# Altium project esp32_and_bmi270.PrjPcb
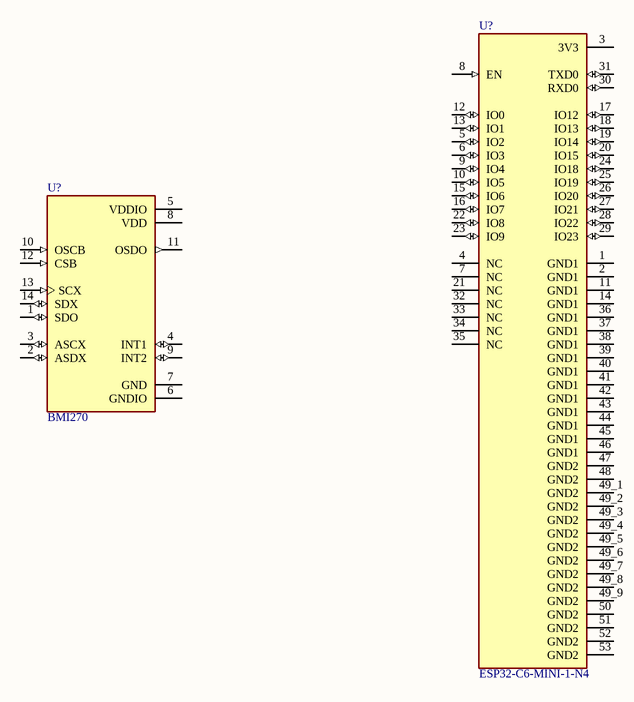
[diagram p0: Sheet1.SchDoc]
1 sheet, 2 parts. Net scope: global (net labels, ports and power ports of the same name join across sheets).
Board file: PCB1.PcbDoc

## Sheet Sheet1.SchDoc
size A4; SheetNumber: 1; SheetTotal: 1

### Parts
(Parts that share a designator on the sheet are numbered #1, #2 ... from top to bottom, then left to right.)
U?#1  ESP32-C6-MINI-1-N4  [XCVR_ESP32-C6-MINI-1-N4]
U?#2  BMI270  [XDCR_BMI270]

### Nets

Not connected (* = marked no-connect by the designer): U?#1 1(GND1) 2(GND1) 3(3V3) 4(NC) 5(IO2) 6(IO3) 7(NC) 8(EN) 9(IO4) 10(IO5) 11(GND1) 12(IO0) 13(IO1) 14(GND1) 15(IO6) 16(IO7) 17(IO12) 18(IO13) 19(IO14) 20(IO15) 21(NC) 22(IO8) 23(IO9) 24(IO18) 25(IO19) 26(IO20) 27(IO21) 28(IO22) 29(IO23) 30(RXD0) 31(TXD0) 32(NC) 33(NC) 34(NC) 35(NC) 36(GND1) 37(GND1) 38(GND1) 39(GND1) 40(GND1) 41(GND1) 42(GND1) 43(GND1) 44(GND1) 45(GND1) 46(GND1) 47(GND2) 48(GND2) 49_1(GND2) 49_2(GND2) 49_3(GND2) 49_4(GND2) 49_5(GND2) 49_6(GND2) 49_7(GND2) 49_8(GND2) 49_9(GND2) 50(GND2) 51(GND2) 52(GND2) 53(GND2); U?#2 1(SDO) 2(ASDX) 3(ASCX) 4(INT1) 5(VDDIO) 6(GNDIO) 7(GND) 8(VDD) 9(INT2) 10(OSCB) 11(OSDO) 12(CSB) 13(SCX) 14(SDX)

### Library data of the parts
U?#1 = ESP32-C6-MINI-1-N4: 802.15.4, Bluetooth, WiFi 802.11ax, Bluetooth v5.0, ZigbeeÂ® Transceiver Module 2.4GHz Antenna Not Included Surface Mount; MF: Espressif Systems; SnapEDA_Link: https://www.snapeda.com/parts/ESP32-C6-MINI-1-N4/Espressif+Systems/view-part/?ref=snap; Package: SMD-53 Espressif Systems; Value: *; MP: ESP32-C6-MINI-1-N4; Check_prices: https://www.snapeda.com/parts/ESP32-C6-MINI-1-N4/Espressif+Systems/view-part/?ref=eda
U?#2 = BMI270: Accelerometer, Gyroscope, 6 Axis Sensor IÂ²C, SPI Output; MF: Bosch Sensortec; Digi-Key_Part_Number: 828-1091-2-ND; Check_prices: https://www.snapeda.com/parts/BMI270/Bosch+Sensortec/view-part/?ref=eda; MP: BMI270; Package: LGA-14 Bosch Sensortec; SnapEDA_Link: https://www.snapeda.com/parts/BMI270/Bosch+Sensortec/view-part/?ref=snap; Value: *; Purchase-URL: https://pricing.snapeda.com/search/part/BMI270/?ref=eda